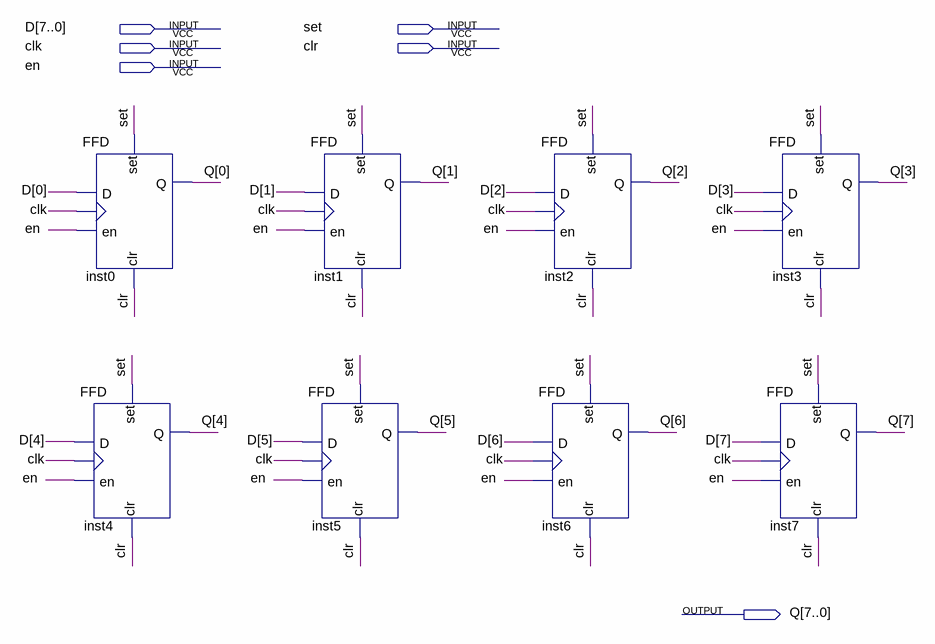
[diagram p0: schematic sheet]
// Quartus schematic REG8.bdf as structural Verilog: 8 symbols, 6 pins
module REG8 (
  input  [7:0] D,
  input  set,
  input  clk,
  input  clr,
  input  en,
  output [7:0] Q
);

  FFD inst0 (.set(set), .D(D[0]), .en(en), .clr(clr), .clk(clk), .Q(Q[0]));
  FFD inst4 (.set(set), .D(D[4]), .en(en), .clr(clr), .clk(clk), .Q(Q[4]));
  FFD inst1 (.set(set), .D(D[1]), .en(en), .clr(clr), .clk(clk), .Q(Q[1]));
  FFD inst5 (.set(set), .D(D[5]), .en(en), .clr(clr), .clk(clk), .Q(Q[5]));
  FFD inst2 (.set(set), .D(D[2]), .en(en), .clr(clr), .clk(clk), .Q(Q[2]));
  FFD inst6 (.set(set), .D(D[6]), .en(en), .clr(clr), .clk(clk), .Q(Q[6]));
  FFD inst3 (.set(set), .D(D[3]), .en(en), .clr(clr), .clk(clk), .Q(Q[3]));
  FFD inst7 (.set(set), .D(D[7]), .en(en), .clr(clr), .clk(clk), .Q(Q[7]));
endmodule
